# Altium schematic sheet Top Sheet.SchDoc
size A
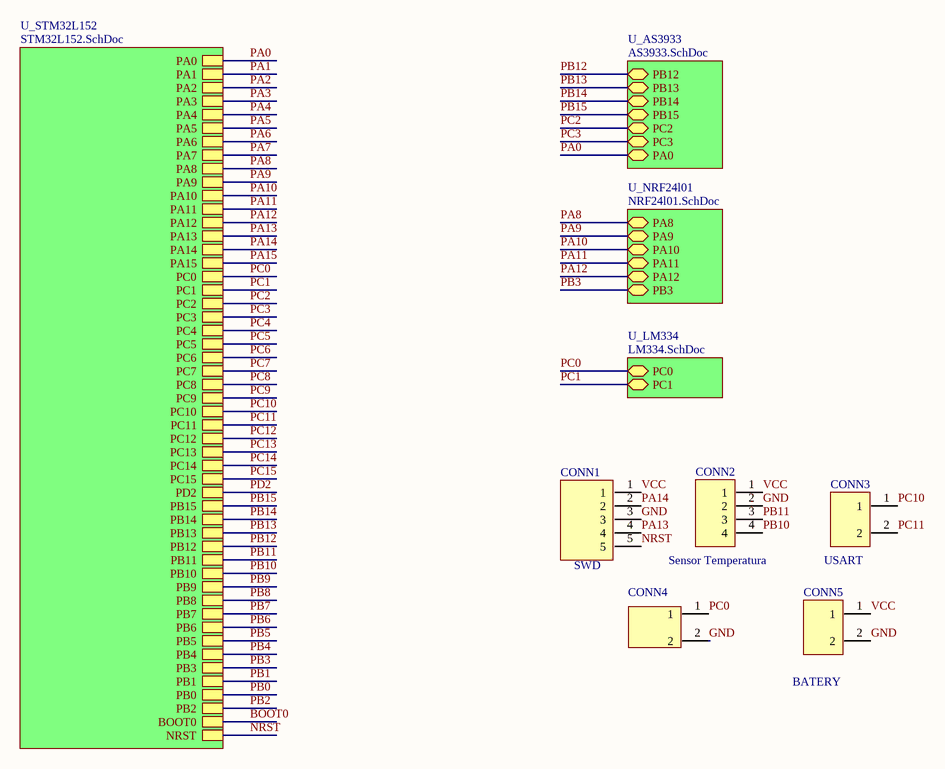
[diagram p0: Top Sheet.SchDoc]

## Parts
CONN1  SWD  [1x5x2.54 Pin Header TH V]
CONN2  Sensor Temperatura  [1x4x2.54 Pin Header TH V]
CONN3  USART  [1x2x2.54 Pin Header TH V]
CONN4  Connector  [1x2x2.54 Pin Header TH V - duplicate]  (value not drawn)
CONN5  BATERY  [1x2X2.54 Horizontal]

## Sub-sheets
U_AS3933 = AS3933.SchDoc: PA0, PC3, PB15, PB14, PC2, PB13, PB12
U_LM334 = LM334.SchDoc: PC1, PC0
U_NRF24l01 = NRF24l01.SchDoc: PB3, PA8, PA9, PA10, PA11, PA12
U_STM32L152 = STM32L152.SchDoc: PA0, PA1, PA2, PA3, PA4, PA5, PA6, PA7, PA8, PA9, PA10, PA11, PA12, PA13, PA14, PA15, PC0, PC1, PC2, PC3, PC4, PC5, PC6, PC7, PC8, PC9, PC10, PC11, PC12, PC13, PC14, PC15, PD2, PB15, PB14, PB13, PB12, PB11, PB10, PB9, PB8, PB7, PB6, PB5, PB4, PB3, PB1, PB0, PB2, BOOT0, NRST

## Nets
BOOT0: sheet U_STM32L152/BOOT0
GND: CONN1.3 CONN2.2 CONN4.2 CONN5.2
NRST: CONN1.5 ; sheet U_STM32L152/NRST
PA0: sheet U_AS3933/PA0, sheet U_STM32L152/PA0
PA1: sheet U_STM32L152/PA1
PA2: sheet U_STM32L152/PA2
PA3: sheet U_STM32L152/PA3
PA4: sheet U_STM32L152/PA4
PA5: sheet U_STM32L152/PA5
PA6: sheet U_STM32L152/PA6
PA7: sheet U_STM32L152/PA7
PA8: sheet U_NRF24l01/PA8, sheet U_STM32L152/PA8
PA9: sheet U_NRF24l01/PA9, sheet U_STM32L152/PA9
PA10: sheet U_NRF24l01/PA10, sheet U_STM32L152/PA10
PA11: sheet U_NRF24l01/PA11, sheet U_STM32L152/PA11
PA12: sheet U_NRF24l01/PA12, sheet U_STM32L152/PA12
PA13: CONN1.4 ; sheet U_STM32L152/PA13
PA14: CONN1.2 ; sheet U_STM32L152/PA14
PA15: sheet U_STM32L152/PA15
PB0: sheet U_STM32L152/PB0
PB1: sheet U_STM32L152/PB1
PB2: sheet U_STM32L152/PB2
PB3: sheet U_NRF24l01/PB3, sheet U_STM32L152/PB3
PB4: sheet U_STM32L152/PB4
PB5: sheet U_STM32L152/PB5
PB6: sheet U_STM32L152/PB6
PB7: sheet U_STM32L152/PB7
PB8: sheet U_STM32L152/PB8
PB9: sheet U_STM32L152/PB9
PB10: CONN2.4 ; sheet U_STM32L152/PB10
PB11: CONN2.3 ; sheet U_STM32L152/PB11
PB12: sheet U_AS3933/PB12, sheet U_STM32L152/PB12
PB13: sheet U_AS3933/PB13, sheet U_STM32L152/PB13
PB14: sheet U_AS3933/PB14, sheet U_STM32L152/PB14
PB15: sheet U_AS3933/PB15, sheet U_STM32L152/PB15
PC0: CONN4.1 ; sheet U_STM32L152/PC0, sheet U_LM334/PC0
PC1: sheet U_STM32L152/PC1, sheet U_LM334/PC1
PC2: sheet U_AS3933/PC2, sheet U_STM32L152/PC2
PC3: sheet U_AS3933/PC3, sheet U_STM32L152/PC3
PC4: sheet U_STM32L152/PC4
PC5: sheet U_STM32L152/PC5
PC6: sheet U_STM32L152/PC6
PC7: sheet U_STM32L152/PC7
PC8: sheet U_STM32L152/PC8
PC9: sheet U_STM32L152/PC9
PC10: CONN3.1 ; sheet U_STM32L152/PC10
PC11: CONN3.2 ; sheet U_STM32L152/PC11
PC12: sheet U_STM32L152/PC12
PC13: sheet U_STM32L152/PC13
PC14: sheet U_STM32L152/PC14
PC15: sheet U_STM32L152/PC15
PD2: sheet U_STM32L152/PD2
VCC: CONN1.1 CONN2.1 CONN5.1

## Library data of the parts
CONN1 = Header 1x5
CONN2 = Header 1x4
CONN3-CONN5 = Header 1x2